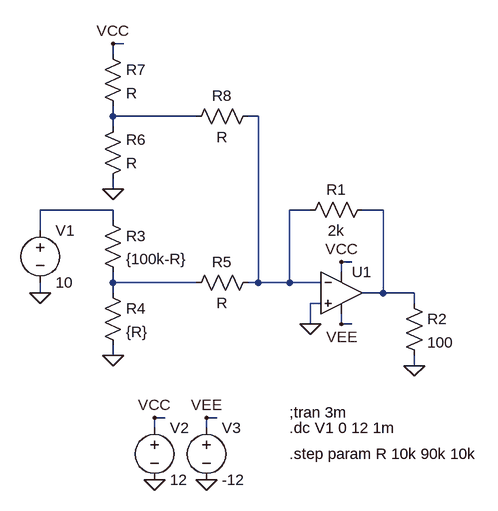
[diagram p0: schematic 3320_FCV.asc]
3320_FCV.asc, the LTspice schematic file:
Version 4
SHEET 1 880 680
WIRE -96 -224 -112 -224
WIRE -112 -208 -112 -224
WIRE -112 -112 -112 -128
WIRE 16 -112 -112 -112
WIRE 112 -112 96 -112
WIRE -112 -96 -112 -112
WIRE -112 0 -112 -16
WIRE -112 32 -224 32
WIRE 192 32 160 32
WIRE 304 32 272 32
WIRE -112 48 -112 32
WIRE -224 64 -224 32
WIRE 256 112 240 112
WIRE 240 128 240 112
WIRE -112 144 -112 128
WIRE 16 144 -112 144
WIRE 112 144 112 -112
WIRE 112 144 96 144
WIRE 160 144 160 32
WIRE 160 144 112 144
WIRE 208 144 160 144
WIRE -224 160 -224 144
WIRE -112 160 -112 144
WIRE 304 160 304 32
WIRE 304 160 272 160
WIRE 352 160 304 160
WIRE 208 176 192 176
WIRE 352 176 352 160
WIRE 192 208 192 176
WIRE 192 208 176 208
WIRE 240 208 240 192
WIRE 256 208 240 208
WIRE -112 256 -112 240
WIRE 352 272 352 256
WIRE -32 352 -48 352
WIRE 48 352 32 352
WIRE -48 368 -48 352
WIRE 32 368 32 352
FLAG 240 112 VCC
FLAG 240 208 VEE
FLAG 192 208 0
FLAG -112 256 0
FLAG -224 160 0
FLAG 352 272 0
FLAG -48 448 0
FLAG 32 448 0
FLAG -48 352 VCC
FLAG 32 352 VEE
FLAG -112 0 0
FLAG -112 -224 VCC
SYMBOL Opamps\\UniversalOpamp2 240 160 R0
SYMATTR InstName U1
SYMBOL res 288 16 R90
WINDOW 0 0 56 VBottom 2
WINDOW 3 32 56 VTop 2
SYMATTR InstName R1
SYMATTR Value 2k
SYMBOL res 336 160 R0
SYMATTR InstName R2
SYMATTR Value 100
SYMBOL res -128 32 R0
SYMATTR InstName R3
SYMATTR Value {100k-R}
SYMBOL res -128 144 R0
SYMATTR InstName R4
SYMATTR Value {R}
SYMBOL voltage -224 48 R0
SYMATTR InstName V1
SYMATTR Value 10
SYMBOL voltage -48 352 R0
WINDOW 123 0 0 Left 0
WINDOW 39 0 0 Left 0
SYMATTR InstName V2
SYMATTR Value 12
SYMBOL voltage 32 352 R0
WINDOW 123 0 0 Left 0
WINDOW 39 0 0 Left 0
SYMATTR InstName V3
SYMATTR Value -12
SYMBOL res 112 128 R90
WINDOW 0 0 56 VBottom 2
WINDOW 3 32 56 VTop 2
SYMATTR InstName R5
SYMBOL res -128 0 M180
WINDOW 0 36 76 Left 2
WINDOW 3 36 40 Left 2
SYMATTR InstName R6
SYMBOL res -128 -224 R0
SYMATTR InstName R7
SYMBOL res 112 -128 R90
WINDOW 0 0 56 VBottom 2
WINDOW 3 32 56 VTop 2
SYMATTR InstName R8
TEXT 160 344 Left 2 !;tran 3m
TEXT 160 368 Left 2 !.dc V1 0 12 1m
TEXT 160 408 Left 2 !.step param R 10k 90k 10k

The netlist it stands for:
* 3320_FCV.asc
XU1 0 N002 VCC VEE N004 level.2 Avol=1Meg GBW=10Meg Slew=10Meg ilimit=25m rail=0 Vos=0 phimargin=45 en=0 enk=0 in=0 ink=0 Rin=500Meg  ; pins IN+ IN- V+ V- OUT
R1 N004 N002 2k
R2 N004 0 100
R3 N003 N005 {100k-R}
R4 N005 0 {R}
V1 N003 0 10
V2 VCC 0 12
V3 VEE 0 -12
R5 N002 N005 R
R6 0 N001 R
R7 VCC N001 R
R8 N002 N001 R
;tran 3m
.dc V1 0 12 1m
.step param R 10k 90k 10k
.lib UniversalOpamps2.sub
.backanno
.end